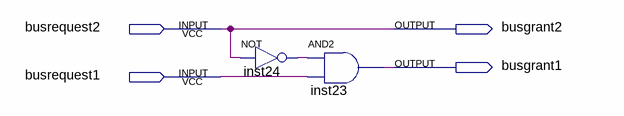
[diagram p0: schematic sheet]
// Quartus schematic arbitr.bdf as structural Verilog: 2 symbols, 4 pins
module arbitr (
  input  busrequest2,
  input  busrequest1,
  output busgrant2,
  output busgrant1
);

  wire inst24_out;

  not inst24 (inst24_out, busrequest2);
  and inst23 (busgrant1, inst24_out, busrequest1);

  assign busgrant2 = busrequest2;
endmodule
